# Altium schematic sheet 06_NRF24L01.SchDoc
size A4; CheckedBy: <审核日期>; Author: llm; CompanyName: 孔乙己图书店; DocumentNumber: 6; SheetNumber: 6; SheetTotal: 6; PageSetup: Record=PageOptions|CenterHorizontal=True|CenterVertical=True|PrintScale=1.00|XCorrection=1.00|YCorrection=1.00|PrintKind=0|BorderSize=5000000|LeftOffset=0|BottomOffset=0|Orientation=2|PaperLength=1000|PaperWidth=1000|Scale=100|PaperSource=7|PrintQuality=600|MediaType=1|DitherType=10|PaperKind=A4|PrintScaleMode=1; DesignDate: <设计日期>; CheckDate: <审核人员>; SheetName: 无线通信; SheetVersion: Rev.F; SheetDescription: <图纸描述>; productName: Fly-Balance
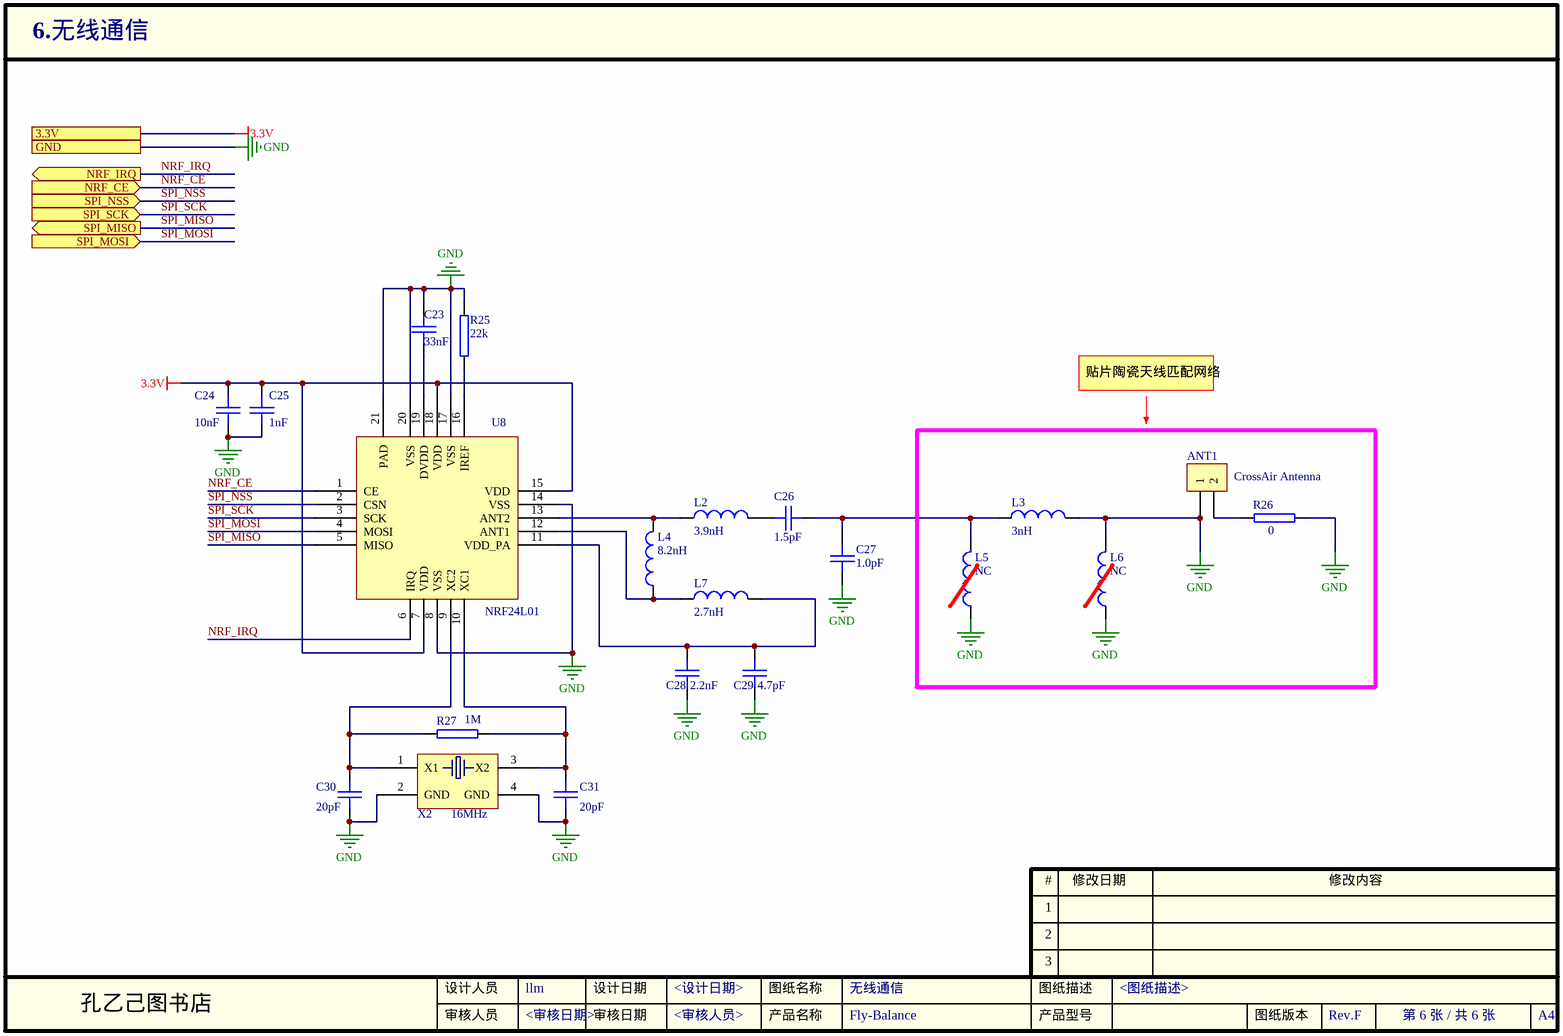
[diagram p0: 06_NRF24L01.SchDoc]

## Parts
ANT1  CrossAir Antenna  [ANT-SMD_L3.1-W1.6]
C23  33nF  [0402C]
C24  10nF  [0402C]
C25  1nF  [0402C]
C26  1.5pF  [0402C]
C27  1.0pF  [0402C]
C28  2.2nF  [0402C]
C29  4.7pF  [0402C]
C30  20pF  [0402C]
C31  20pF  [0402C]
L2  3.9nH  [0402R]
L3  3nH  [0402R]
L4  8.2nH  [0402R]
L5  NC  [0402R]
L6  NC  [0402R]
L7  2.7nH  [0402R]
R25  22k  [0402R]
R26  0  [0402R]
R27  1M  [0402R]
U8  NRF24L01  [QFN-20_L4.0-W4.0-P0.50-BL-EP]
X2  16MHz  [OSCCC250X320X80-4N]

## Ports
3.3V, GND, NRF_CE (in), NRF_IRQ (out), SPI_MISO (out), SPI_MOSI (in), SPI_NSS (in), SPI_SCK (in)

## Nets
3.3V: C24.1 C25.1 U8.7(VDD) U8.15(VDD) U8.18(VDD) ; port 3.3V
GND: ANT1.1 C23.1 C24.2 C25.2 C27.1 C28.2 C29.2 C30.1 C31.1 L3.2 L5.1 L6.1 L6.2 R25.1 R26.2 U8.8(VSS) U8.14(VSS) U8.17(VSS) U8.20(VSS) U8.21(PAD) X2.2(GND) X2.4(GND) ; port GND
NRF_CE: U8.1(CE) ; port NRF_CE
NRF_IRQ: U8.6(IRQ) ; port NRF_IRQ
SPI_MISO: U8.5(MISO) ; port SPI_MISO
SPI_MOSI: U8.4(MOSI) ; port SPI_MOSI
SPI_NSS: U8.2(CSN) ; port SPI_NSS
SPI_SCK: U8.3(SCK) ; port SPI_SCK
NetANT1_2: ANT1.2 R26.1
NetC23_2: C23.2 U8.19(DVDD)
NetC26_1: C26.1 L2.2
NetC26_2: C26.2 C27.2 L3.1 L5.2
NetC28_1: C28.1 C29.1 L7.2 U8.11(VDD_PA)
NetC30_2: C30.2 R27.1 U8.9(XC2) X2.1(X1)
NetC31_2: C31.2 R27.2 U8.10(XC1) X2.3(X2)
NetL2_1: L2.1 L4.2 U8.13(ANT2)
NetL4_1: L4.1 L7.1 U8.12(ANT1)
NetR25_2: R25.2 U8.16(IREF)

## Notes on the sheet
- 贴片陶瓷天线匹配网络
- 1
- #
- 修改日期
- 修改内容
- 2
- 3
- 设计人员
- 审核人员
- 设计日期
- 审核日期
- 产品名称
- 图纸名称
- 产品型号
- 图纸描述
- 图纸版本
- A4

## Library data of the parts
ANT1 = CON2: Connector
C23-C31 = CAP: 电容
L2-L7 = INDUCTOR_1: 电感
R25-R27 = RES: 电阻
U8 = NRF24L01: 2.4G无线通信芯片
X2 = XTAL4: 4pin贴片无源晶振